# Altium project Gateway.PrjPcb
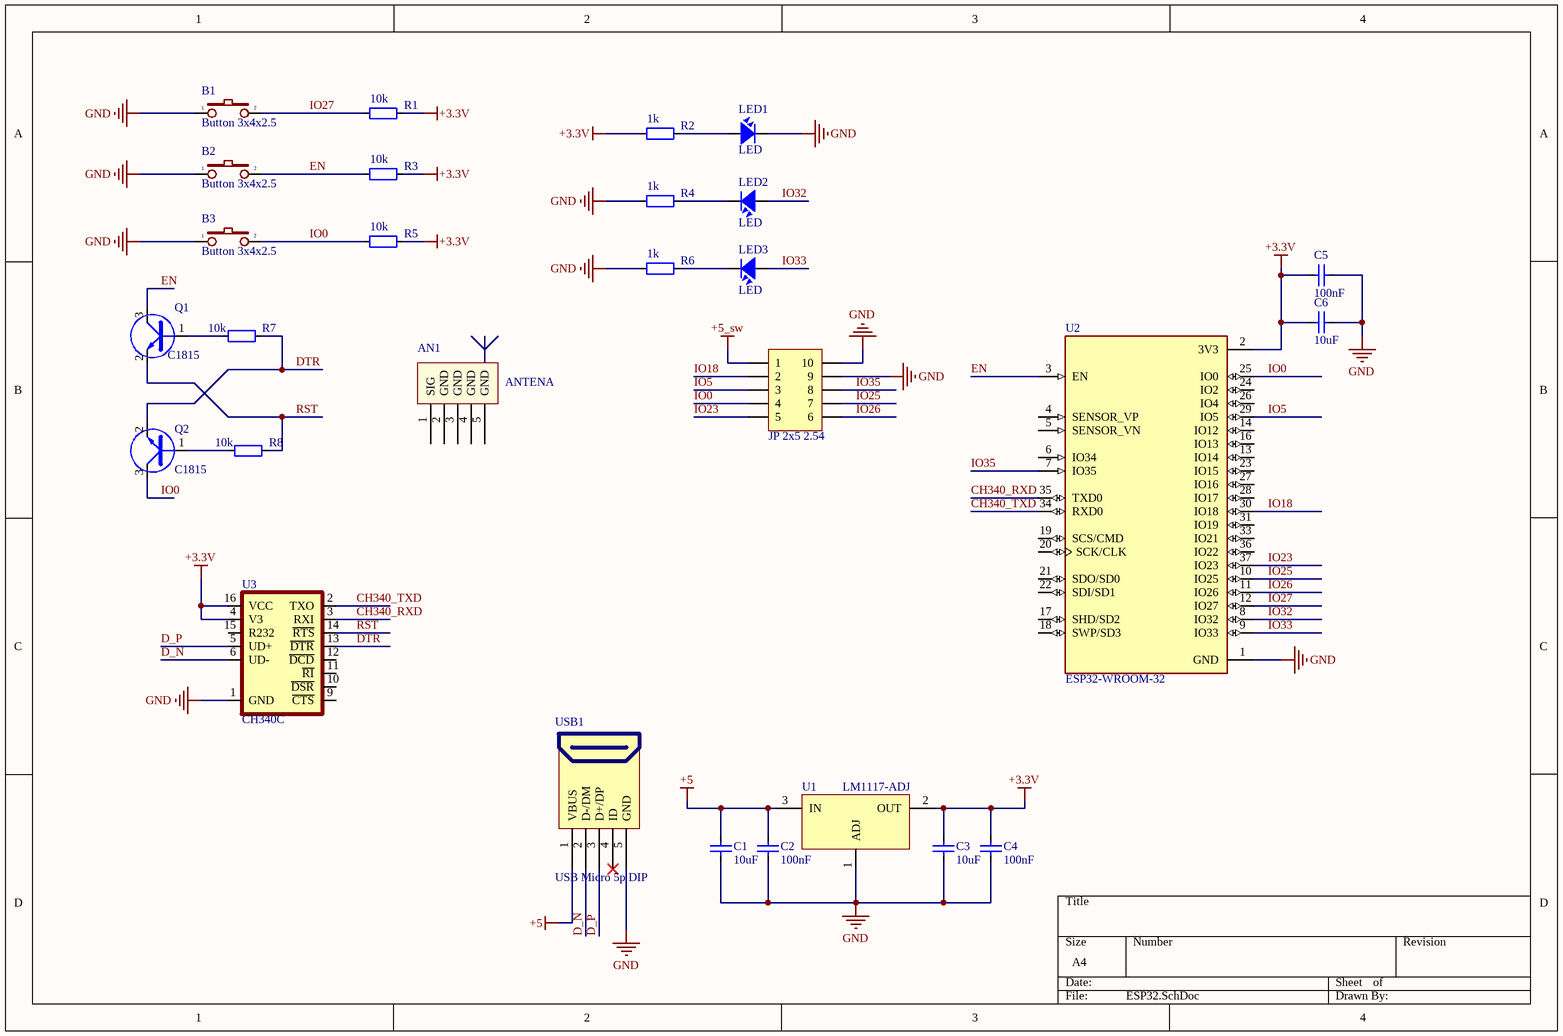
[diagram p0: ESP32.SchDoc]
2 sheets, 53 parts. Net scope: global (net labels, ports and power ports of the same name join across sheets).
Board file: GatewayV1.PcbDoc
Sheets:
  ESP32.SchDoc
  Power.SchDoc

## Sheet ESP32.SchDoc
size A4; SheetNumber: 1; SheetTotal: 2

### Parts
AN1  ANTENA  [DE ANTEN SMA CONG]
B1  Button 3x4x2.5  [Button 3x4x2.5]
B2  Button 3x4x2.5  [Button 3x4x2.5]
B3  Button 3x4x2.5  [Button 3x4x2.5]
C1  10uF  [CAP_0805]
C2  100nF  [CAP_0805]
C3  10uF  [CAP_0805]
C4  100nF  [CAP_0805]
C5  100nF  [CAP_0805]
C6  10uF  [CAP_0805]
JP1  JP 2x5 2.54  [JP 2x5 DT]
LED1  LED  [LED-0805-Red]
LED2  LED  [LED-0805-Red]
LED3  LED  [LED-0805-Red]
Q1  C1815  [SOT23D]
Q2  C1815  [SOT23D]
R1  10k  [RES-SMD-0805]
R2  1k  [RES-SMD-0805]
R3  10k  [RES-SMD-0805]
R4  1k  [RES-SMD-0805]
R5  10k  [RES-SMD-0805]
R6  1k  [RES-SMD-0805]
R7  10k  [RES-SMD-0805]
R8  10k  [RES-SMD-0805]
U1  LM1117-ADJ  [LM1117-SOP]
U2  ESP32-WROOM-32  [MODULE_ESP32-WROOM-32]
U3  CH340C  [SO016]
USB1  USB Micro 5p DIP  [USB Micro 5p DIP]

### Nets
+3.3V: C3.1 C4.1 C5.1 C6.1 R1.1 R2.2 R3.1 R5.1 U1.2(OUT) U2.2(3V3) U3.4(V3) U3.16(VCC)
+5: C1.1 C2.1 U1.3(IN) USB1.1(VBUS)
+5_sw: JP1.1
GND: B1.1 B2.1 B3.1 C1.2 C2.2 C3.2 C4.2 C5.2 C6.2 JP1.9 JP1.10 LED1.2 R4.2 R6.2 U1.1(ADJ) U2.1(GND) U3.1(GND) USB1.5(GND)
CH340_RXD: U2.35(TXD0) U3.3(RXI)
CH340_TXD: U2.34(RXD0) U3.2(TXO)
D_N: U3.6(UD-) USB1.2(D-/DM)
D_P: U3.5(UD+) USB1.3(D+/DP)
DTR: Q2.2(E) R7.1 U3.13(~{DTR})
EN: B2.2 Q1.3(C) R3.2 U2.3(EN)
IO0: B3.2 JP1.4 Q2.3(C) R5.2 U2.25(IO0)
IO5: JP1.3 U2.29(IO5)
IO18: JP1.2 U2.30(IO18)
IO23: JP1.5 U2.37(IO23)
IO25: JP1.7 U2.10(IO25)
IO26: JP1.6 U2.11(IO26)
IO27: B1.2 R1.2 U2.12(IO27)
IO32: LED2.1 U2.8(IO32)
IO33: LED3.1 U2.9(IO33)
IO35: JP1.8 U2.7(IO35)
RST: Q1.2(E) R8.1 U3.14(~{RTS})
NetLED1_1: LED1.1 R2.1
NetLED2_2: LED2.2 R4.1
NetLED3_2: LED3.2 R6.1
NetQ1_1: Q1.1(B) R7.2
NetQ2_1: Q2.1(B) R8.2

Not connected (* = marked no-connect by the designer): AN1 1(SIG) 2(GND) 3(GND) 4(GND) 5(GND); U2 4(SENSOR_VP) 5(SENSOR_VN) 6(IO34) 13(IO14) 14(IO12) 16(IO13) 17(SHD/SD2) 18(SWP/SD3) 19(SCS/CMD) 20(SCK/CLK) 21(SDO/SD0) 22(SDI/SD1) 23(IO15) 24(IO2) 26(IO4) 27(IO16) 28(IO17) 31(IO19) 33(IO21) 36(IO22); U3 9(~{CTS}) 10(~{DSR}) 11(~{RI}) 12(~{DCD}) 15(R232); USB1 4(ID)*

### Library data of the parts
AN1 = ANTEN SMA CONG: Generic Antenna
C1-C6 = CapSMD: Capacitor; Value: 33p; Published: 8-Jun-2000; LatestRevisionDate: 17-Jul-2002; LatestRevisionNote: Re-released for DXP Platform.; PackageReference: RAD-0.3; Publisher: Altium Limited
JP1 = JP 2x5 2.54 Duc Thang: Cắm; Ten_Linh_Kien: Jump Đôi Đực 2.54MM 2x40P Thẳng 11MM; Don_Vi: Con; Ma_Hang: MH002686; Ghi_Chu: *; Kieu_Chan: *; Chung_Loai: Cắm
LED1-LED3 = LED: LED Single colour Green and Red; Value: LED 3 ly Single Colour
Q1 Q2 = 2SC1815: NPN 600mW, ECB; Value: C1815
R1-R8 = Resistor - SMD: Resistor; Manufacturer: Generic Components; Class: Passive; Published: 08/06/2000; Publisher: Altium Hobart Technology Centre
U1 = LM1117-ADJ: 800mA Low-Dropout Linear Regulator; Creator: Nguyen Ba Bien; Website: http://group3i.net
U2 = ESP32-WROOM-32: Bluetooth, WiFi Transceiver Module 2.4GHz ~ 2.5GHz Surface Mount; MF: Espressif Systems; Package: Module Espressif Systems; Digi-Key_Part_Number: 1904-1010-1-ND; Digi-Key_Purchase_URL: https://www.digikey.com/product-detail/en/espressif-systems/ESP32-WROOM-32/1904-1010-1-ND/8544305?utm_source=snapeda&utm_medium=aggregator&utm_campaign=symbol; Value: *; MP: ESP32-WROOM-32; SnapEDA_Link: https://www.snapeda.com/parts/ESP32-WROOM-32/Espressif%20Systems/view-part/2753322/?ref=snap
U3 = CH340C: USB to serial chip CH340; MF: WCH; Package: Package; Check_prices: https://www.snapeda.com/parts/CH340C/WCH/view-part/5428851/?ref=eda; Value: *; Price: None; MP: CH340C; Availability: Unavailable; SnapEDA_Link: https://www.snapeda.com/parts/CH340C/WCH/view-part/5428851/?ref=snap
USB1 = USB Micro 5p DIP: USB Type B; Ten: MicroUSB MK5P DIP; Ma_Hang: MH005145

## Sheet Power.SchDoc
size A3; SheetNumber: 2; SheetTotal: 2
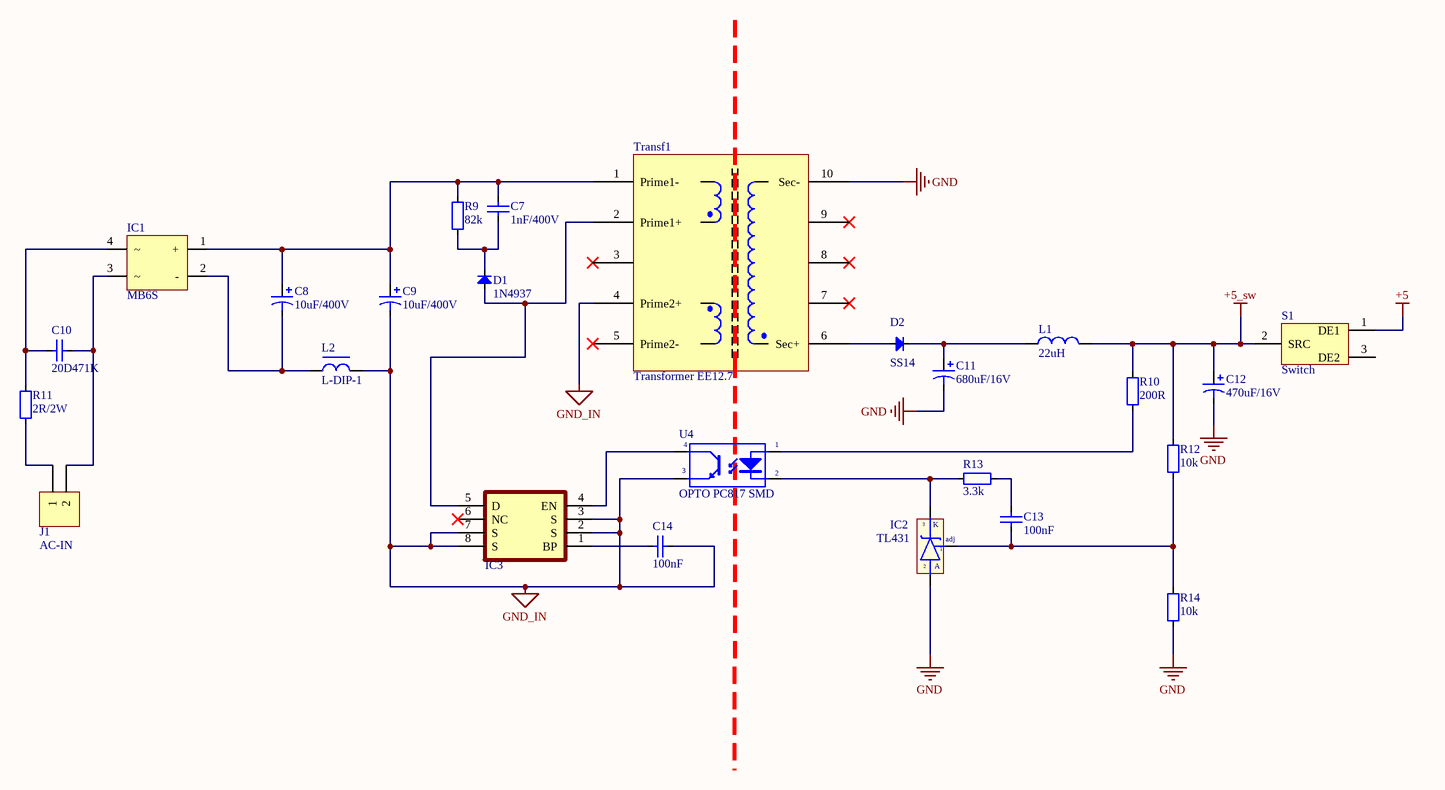
[diagram p1: Power.SchDoc]

### Parts
C7  1nF/400V  [103/2KV]
C8  10uF/400V  [C10mm]
C9  10uF/400V  [C10mm]
C10  20D471K  [103/2KV]
C11  680uF/16V  [C8mm]
C12  470uF/16V  [C8mm]
C13  100nF  [CAP_0805]
C14  100nF  [CAP_0805]
D1  1N4937  [DIO-1AN]
D2  SS14  [DO-214AC(SMA)]
IC1  MB6S  [MB6S]
IC2  TL431  [TL431_SOT]
IC3  TNY264  [DIP8]  (value not drawn)
J1  AC-IN  [KF2-5.08]
L1  22uH  [L_SMD]
L2  L-DIP-1  [Inductor]
R9  82k  [RES-SMD-2512]
R10  200R  [RES-SMD-0805]
R11  2R/2W  [RES-1WW]
R12  10k  [RES-SMD-0805]
R13  3.3k  [RES-SMD-0805]
R14  10k  [RES-SMD-0805]
S1  Switch  [Switch]
Transf1  Transformer EE12.7  [Transformer EE12.7]
U4  OPTO PC817 SMD  [SOP4]

### Nets
+5: S1.1(DE1)
+5_sw: C12.1 L1.2 R10.1 R12.1 S1.2(SRC)
GND: C11.2 C12.2 IC2.2(A) R14.2 Transf1.10(Sec-)
GND_IN: C9.2 C14.1 IC3.2(S) IC3.3(S) IC3.7(S) IC3.8(S) L2.2 Transf1.4(Prime2+) U4.3(E)
NetC7_1: C7.1 C8.1 C9.1 IC1.1(+) R9.1 Transf1.1(Prime1-)
NetC7_2: C7.2 D1.2(K) R9.2
NetC8_2: C8.2 IC1.2(-) L2.1
NetC10_1: C10.1 IC1.3 J1.2
NetC10_2: C10.2 IC1.4 R11.1
NetC11_1: C11.1 D2.2(K) L1.1
NetC13_1: C13.1 IC2.1(adj) R12.2 R14.1
NetC13_2: C13.2 R13.2
NetC14_2: C14.2 IC3.1(BP)
NetD1_1: D1.1(A) IC3.5(D) Transf1.2(Prime1+)
NetD2_1: D2.1(A) Transf1.6(Sec+)
NetIC2_3: IC2.3(K) R13.1 U4.2(K)
NetIC3_4: IC3.4(EN) U4.4(C)
NetJ1_1: J1.1 R11.2
NetR10_2: R10.2 U4.1(A)

Not connected (* = marked no-connect by the designer): IC3 6(NC)*; S1 3(DE2) 4 5; Transf1 3* 5(Prime2-)* 7* 8* 9*

### Library data of the parts
C7 = Cap2KV: CAP CERAMIC; Published: 8-Jun-2000; LatestRevisionDate: 17-Jul-2002; LatestRevisionNote: Re-released for DXP Platform.; PackageReference: RAD-0.3; Publisher: Altium Limited
C8 C9 C11 C12 = Cap Pol: Polarized Capacitor (Axial); Published: 8-Jun-2000; LatestRevisionDate: 17-Jul-2002; LatestRevisionNote: Re-released for DXP Platform.; PackageReference: POLAR0.8; Publisher: Altium Limited
C10 = Cap2KV: Varistor; Published: 8-Jun-2000; LatestRevisionDate: 17-Jul-2002; LatestRevisionNote: Re-released for DXP Platform.; PackageReference: RAD-0.3; Publisher: Altium Limited
C13 C14 = CapSMD: Capacitor; Value: 33p; Published: 8-Jun-2000; LatestRevisionDate: 17-Jul-2002; LatestRevisionNote: Re-released for DXP Platform.; PackageReference: RAD-0.3; Publisher: Altium Limited
D1 = Diode SMD: Diode Schottky / 1N4937; Code - JEDEC: DO-214-AB; Value: 1N5007; Published: 8-Jun-2000; Revision: July-2002: Re-released for DXP Platform.; Publisher: Altium Limited
D2 = Diode SMD: Diode Schottky / 1N5819; Code - JEDEC: DO-214-AB; Value: 1N5007; Published: 8-Jun-2000; Revision: July-2002: Re-released for DXP Platform.; Publisher: Altium Limited
IC2 = TL431: Programmable Shunt Regulator; Value: TL431
IC3 = TNY264: Enhanced, Energy Efficient, Low Power Off-line Switcher
J1 = KF2: Manufacturer: Würth Elektronik eiSos GmbH; partNo: 691103110002; ComponentLink1 Description: Manufacturer; ComponentLink2 Description: Datasheet; NoPins: 2; Created Date: 29 October 2013; ComponentLink1URL: http://www.we-online.com; ComponentLink2URL: http://katalog.we-online.de/em/datasheet/6911031100xx.pdf; Created by: Karrer Zheng
L1 = Inductor: CD73R 22uH 1.23A 7345; Value: 150 mH
L2 = L-DIP-1: Inductor; Value: 150 mH
R9-R14 = Resistor - SMD: as R1 on sheet ESP32; Published: 08/06/2000; Publisher: Altium Hobart Technology Centre
Transf1 = Tranformer EE16
U4 = OPTO PC817 SMD: Single Opto; Value: PC817

## Nets that join several sheets
+5: ESP32 (C1.1 C2.1 U1.3 USB1.1), Power (S1.1)
+5_sw: ESP32 (JP1.1), Power (5 pins)
GND: ESP32 (18 pins), Power (5 pins)